# EAGLE design IO_Board (EAGLE 7.3.0)
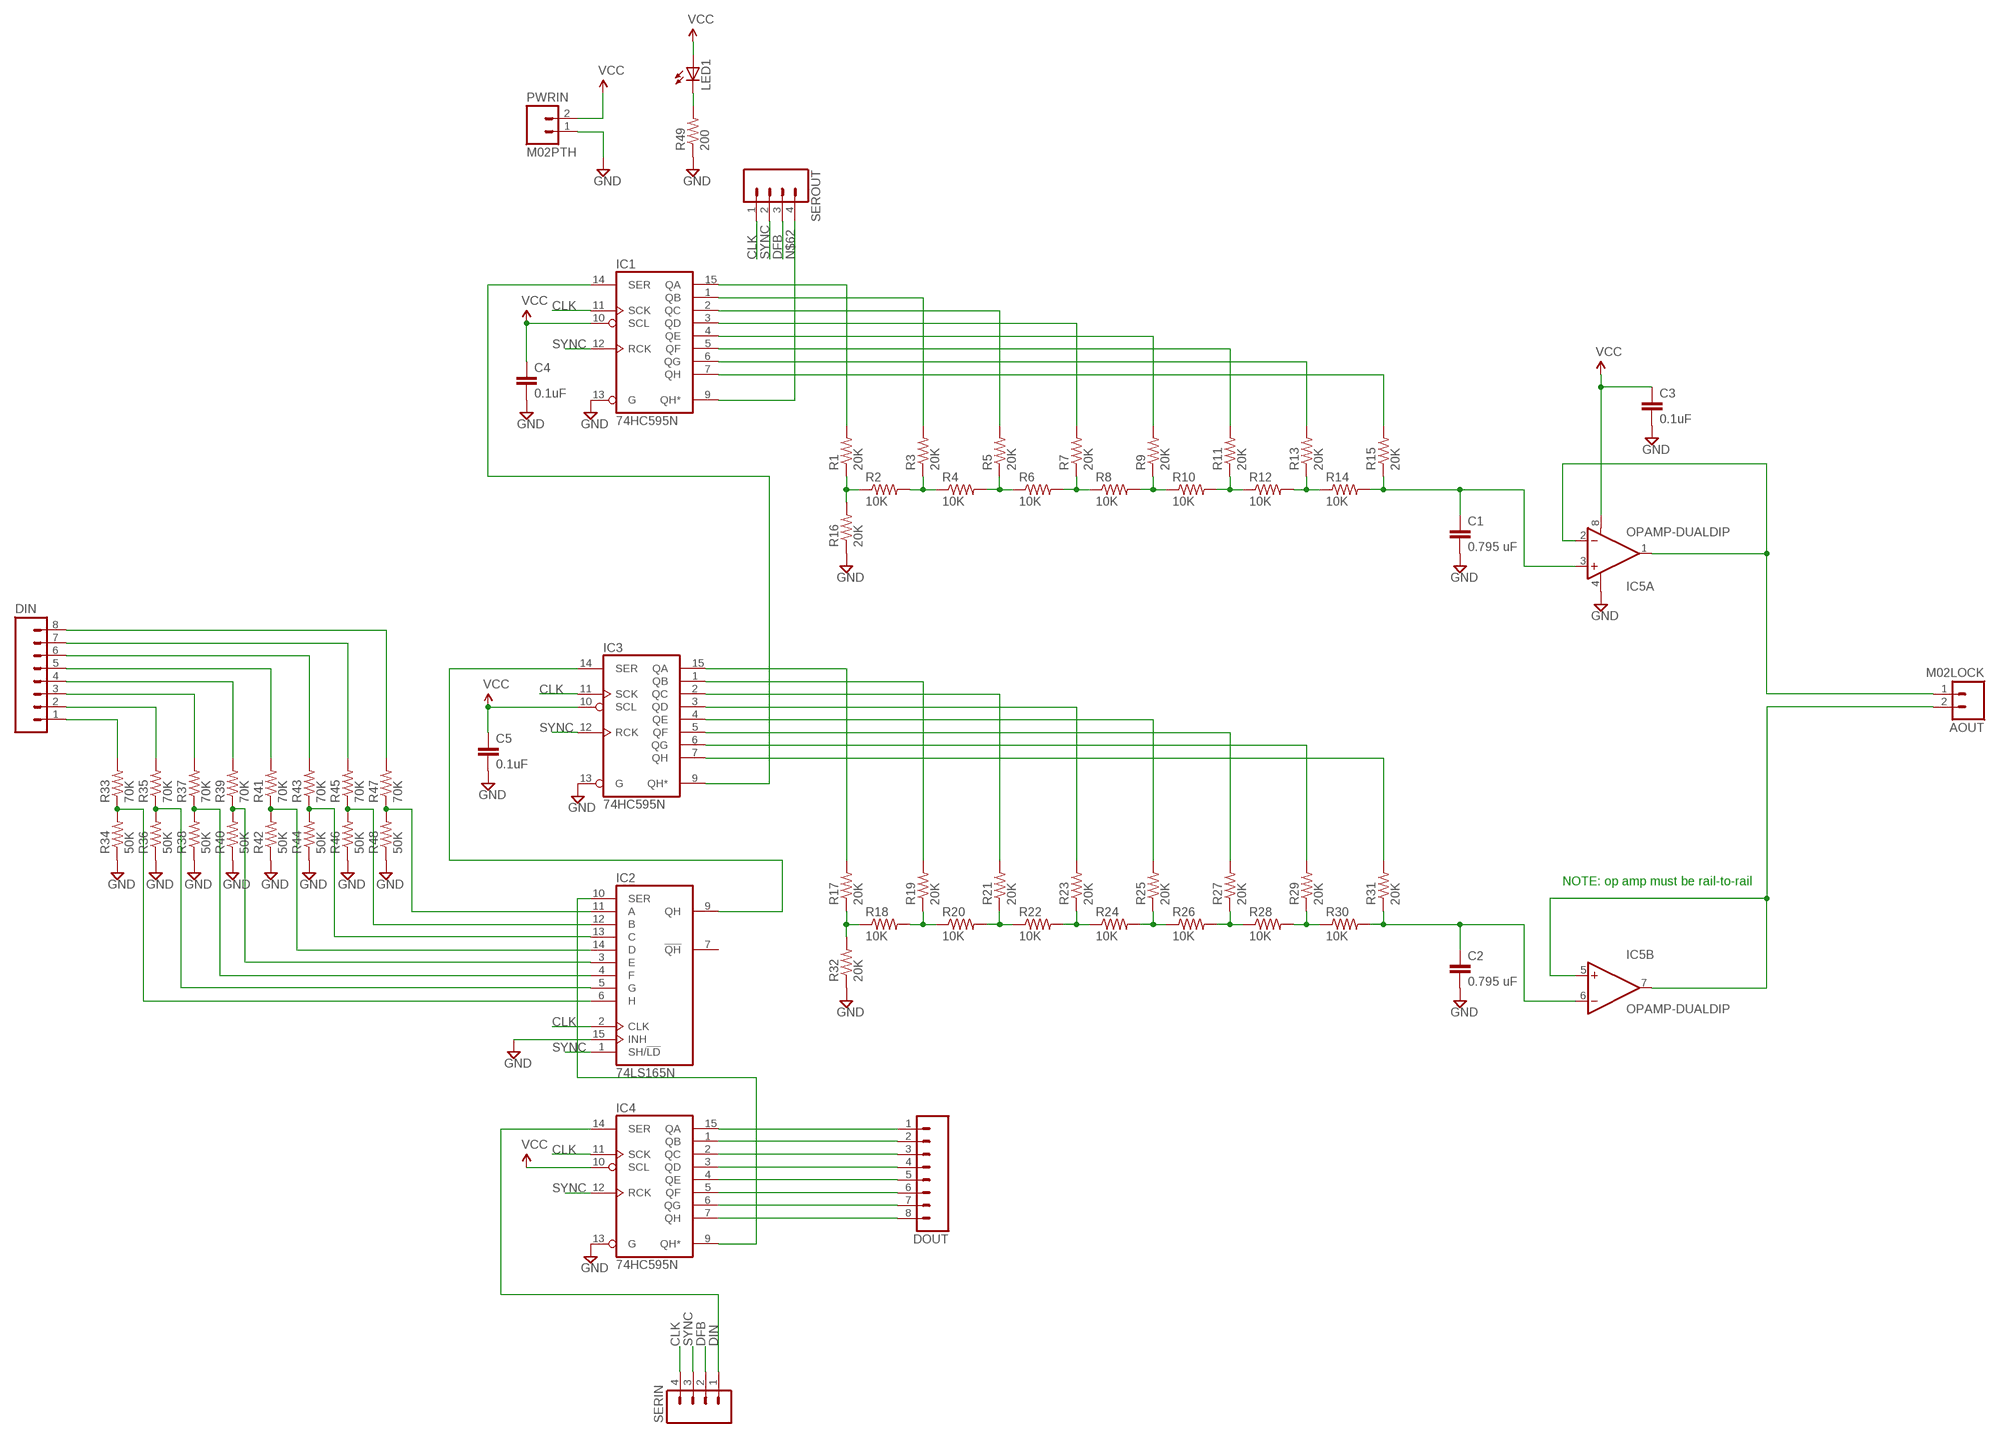
[diagram p0: schematic, sheet 1]

## Parts
AOUT  M02LOCK  [1X02_LOCK]
C1  0.795 uF  CAPPTH  [CAP-PTH-SMALL]
C2  0.795 uF  CAPPTH  [CAP-PTH-SMALL]
C3  0.1uF  CAPPTH  [CAP-PTH-SMALL]
C4  0.1uF  CAPPTH  [CAP-PTH-SMALL]
C5  0.1uF  CAPPTH  [CAP-PTH-SMALL]
DIN  M08LOCK  [1X08_LOCK]
DOUT  M08LOCK  [1X08_LOCK]
IC1  74HC595N  [DIL16]
IC2  74LS165N  [DIL16]
IC3  74HC595N  [DIL16]
IC4  74HC595N  [DIL16]
IC5  OPAMP-DUALDIP  [DIP08]
LED1  LED5MM  [LED5MM]
PWRIN  M02PTH  [1X02]
R1  20K  RESISTORPTH-1/4W-VERT  [AXIAL-0.1]
R2  10K  RESISTORPTH-1/4W-VERT  [AXIAL-0.1]
R3  20K  RESISTORPTH-1/4W-VERT  [AXIAL-0.1]
R4  10K  RESISTORPTH-1/4W-VERT  [AXIAL-0.1]
R5  20K  RESISTORPTH-1/4W-VERT  [AXIAL-0.1]
R6  10K  RESISTORPTH-1/4W-VERT  [AXIAL-0.1]
R7  20K  RESISTORPTH-1/4W-VERT  [AXIAL-0.1]
R8  10K  RESISTORPTH-1/4W-VERT  [AXIAL-0.1]
R9  20K  RESISTORPTH-1/4W-VERT  [AXIAL-0.1]
R10  10K  RESISTORPTH-1/4W-VERT  [AXIAL-0.1]
R11  20K  RESISTORPTH-1/4W-VERT  [AXIAL-0.1]
R12  10K  RESISTORPTH-1/4W-VERT  [AXIAL-0.1]
R13  20K  RESISTORPTH-1/4W-VERT  [AXIAL-0.1]
R14  10K  RESISTORPTH-1/4W-VERT  [AXIAL-0.1]
R15  20K  RESISTORPTH-1/4W-VERT  [AXIAL-0.1]
R16  20K  RESISTORPTH-1/4W-VERT  [AXIAL-0.1]
R17  20K  RESISTORPTH-1/4W-VERT  [AXIAL-0.1]
R18  10K  RESISTORPTH-1/4W-VERT  [AXIAL-0.1]
R19  20K  RESISTORPTH-1/4W-VERT  [AXIAL-0.1]
R20  10K  RESISTORPTH-1/4W-VERT  [AXIAL-0.1]
R21  20K  RESISTORPTH-1/4W-VERT  [AXIAL-0.1]
R22  10K  RESISTORPTH-1/4W-VERT  [AXIAL-0.1]
R23  20K  RESISTORPTH-1/4W-VERT  [AXIAL-0.1]
R24  10K  RESISTORPTH-1/4W-VERT  [AXIAL-0.1]
R25  20K  RESISTORPTH-1/4W-VERT  [AXIAL-0.1]
R26  10K  RESISTORPTH-1/4W-VERT  [AXIAL-0.1]
R27  20K  RESISTORPTH-1/4W-VERT  [AXIAL-0.1]
R28  10K  RESISTORPTH-1/4W-VERT  [AXIAL-0.1]
R29  20K  RESISTORPTH-1/4W-VERT  [AXIAL-0.1]
R30  10K  RESISTORPTH-1/4W-VERT  [AXIAL-0.1]
R31  20K  RESISTORPTH-1/4W-VERT  [AXIAL-0.1]
R32  20K  RESISTORPTH-1/4W-VERT  [AXIAL-0.1]
R33  70K  RESISTORPTH-1/4W-VERT  [AXIAL-0.1]
R34  50K  RESISTORPTH-1/4W-VERT  [AXIAL-0.1]
R35  70K  RESISTORPTH-1/4W-VERT  [AXIAL-0.1]
R36  50K  RESISTORPTH-1/4W-VERT  [AXIAL-0.1]
R37  70K  RESISTORPTH-1/4W-VERT  [AXIAL-0.1]
R38  50K  RESISTORPTH-1/4W-VERT  [AXIAL-0.1]
R39  70K  RESISTORPTH-1/4W-VERT  [AXIAL-0.1]
R40  50K  RESISTORPTH-1/4W-VERT  [AXIAL-0.1]
R41  70K  RESISTORPTH-1/4W-VERT  [AXIAL-0.1]
R42  50K  RESISTORPTH-1/4W-VERT  [AXIAL-0.1]
R43  70K  RESISTORPTH-1/4W-VERT  [AXIAL-0.1]
R44  50K  RESISTORPTH-1/4W-VERT  [AXIAL-0.1]
R45  70K  RESISTORPTH-1/4W-VERT  [AXIAL-0.1]
R46  50K  RESISTORPTH-1/4W-VERT  [AXIAL-0.1]
R47  70K  RESISTORPTH-1/4W-VERT  [AXIAL-0.1]
R48  50K  RESISTORPTH-1/4W-VERT  [AXIAL-0.1]
R49  200  RESISTORPTH-1/4W-VERT  [AXIAL-0.1]
SERIN  M04LOCK  [1X04_LOCK]
SEROUT  M04LOCK  [1X04_LOCK]

## Nets
CLK [Clk]: IC1.11(SCK) IC2.2(CLK) IC3.11(SCK) IC4.11(SCK) SERIN.4 SEROUT.1
DFB [Data]: SERIN.2 SEROUT.3
DIN [Data]: IC4.14(SER) SERIN.1
GND: C1.2 C2.2 C3.2 C4.2 C5.2 IC1.13(G) IC2.15(INH) IC3.13(G) IC4.13(G) IC5.4(A:V-) PWRIN.1 R16.P$1 R32.P$1 R34.P$1 R36.P$1 R38.P$1 R40.P$1 R42.P$1 R44.P$1 R46.P$1 R48.P$1 R49.P$1
N$1: IC1.7(QH) R15.P$2
N$2: AOUT.2 IC5.5(B:+IN) IC5.7(B:OUT)
N$3: IC1.6(QG) R13.P$2
N$4: IC1.5(QF) R11.P$2
N$5: IC1.4(QE) R9.P$2
N$6: IC1.3(QD) R7.P$2
N$7: IC1.2(QC) R5.P$2
N$8: IC1.1(QB) R3.P$2
N$9: IC1.15(QA) R1.P$2
N$10: R1.P$1 R2.P$1 R16.P$2
N$11: R2.P$2 R3.P$1 R4.P$1
N$12: R4.P$2 R5.P$1 R6.P$1
N$13: R6.P$2 R7.P$1 R8.P$1
N$14: R8.P$2 R9.P$1 R10.P$1
N$15: R10.P$2 R11.P$1 R12.P$1
N$16: R12.P$2 R13.P$1 R14.P$1
N$17: C1.1 IC5.3(A:+IN) R14.P$2 R15.P$1
N$18: AOUT.1 IC5.1(A:OUT) IC5.2(A:-IN)
N$19: IC3.7(QH) R31.P$2
N$20: IC3.6(QG) R29.P$2
N$21: IC3.5(QF) R27.P$2
N$22: IC3.4(QE) R25.P$2
N$23: IC3.3(QD) R23.P$2
N$24: IC3.2(QC) R21.P$2
N$25: IC3.1(QB) R19.P$2
N$26: IC3.15(QA) R17.P$2
N$27: R17.P$1 R18.P$1 R32.P$2
N$28: R18.P$2 R19.P$1 R20.P$1
N$29: R20.P$2 R21.P$1 R22.P$1
N$30: R22.P$2 R23.P$1 R24.P$1
N$31: R24.P$2 R25.P$1 R26.P$1
N$32: R26.P$2 R27.P$1 R28.P$1
N$33: R28.P$2 R29.P$1 R30.P$1
N$34: C2.1 IC5.6(B:-IN) R30.P$2 R31.P$1
N$35: IC2.6(H) R33.P$1 R34.P$2
N$36: IC2.5(G) R35.P$1 R36.P$2
N$37: IC2.4(F) R37.P$1 R38.P$2
N$38: IC2.3(E) R39.P$1 R40.P$2
N$39: IC2.14(D) R41.P$1 R42.P$2
N$40: IC2.13(C) R43.P$1 R44.P$2
N$41: IC2.12(B) R45.P$1 R46.P$2
N$42: IC2.11(A) R47.P$1 R48.P$2
N$43: DOUT.1 IC4.15(QA)
N$44: DOUT.2 IC4.1(QB)
N$45: DOUT.3 IC4.2(QC)
N$46: DOUT.4 IC4.3(QD)
N$47: DOUT.5 IC4.4(QE)
N$48: DOUT.6 IC4.5(QF)
N$49: DOUT.7 IC4.6(QG)
N$50: DOUT.8 IC4.7(QH)
N$51: DIN.8 R47.P$2
N$52: DIN.7 R45.P$2
N$53: DIN.6 R43.P$2
N$54: DIN.5 R41.P$2
N$55: DIN.4 R39.P$2
N$56: DIN.3 R37.P$2
N$57: DIN.2 R35.P$2
N$58: DIN.1 R33.P$2
N$59 [Data]: IC2.10(SER)
N$60 [Data]: IC2.9(QH) IC3.14(SER)
N$61: LED1.K(C) R49.P$2
N$62 [Data]: IC1.9(QH*) SEROUT.4
N$63 [Data]: IC1.14(SER) IC3.9(QH*)
SYNC [Sync]: IC1.12(RCK) IC2.1(SH/!LD) IC3.12(RCK) IC4.12(RCK) SERIN.3 SEROUT.2
VCC: C3.1 C4.1 C5.1 IC1.10(SCL) IC3.10(SCL) IC4.10(SCL) IC5.8(A:V+) LED1.A PWRIN.2
Unconnected: IC2.7(!QH) IC4.9(QH*)

## Notes on the sheet
- NOTE: op amp must be rail-to-rail

## Power pins joined to a net without a drawn wire
GND: IC1.8(GND) IC2.8(GND) IC3.8(GND) IC4.8(GND)
VCC: IC1.16(VCC) IC2.16(VCC) IC3.16(VCC) IC4.16(VCC)

## Library data of the parts
AOUT PWRIN = SparkFun-Connectors:M02: Standard 2-pin 0.1" header. Use with - straight break away headers ( PRT-00116) - right angle break away headers (PRT-00553) - swiss pins (PRT-00743) - machine pins (PRT-00117) - female headers (PRT-00115) Molex polarized connector foot print use with: PRT-08233 with associated crimp pins and housings. 2.54_SCREWTERM for use with PRT-10571. 3.5mm Screw Terminal footprints for PRT-08084 5mm Screw Terminal footprints for use with PRT-08433
C1-C5 = SparkFun-Passives:CAP: Capacitor Standard 0603 ceramic capacitor, and 0.1" leaded capacitor.
DIN DOUT = SparkFun-Connectors:M08: Header 8 Standard 8-pin 0.1" header. Use with straight break away headers (SKU : PRT-00116), right angle break away headers (PRT-00553), swiss pins (PRT-00743), machine pins (PRT-00117), and female headers (PRT-00115).
IC1 IC3 IC4 = 74xx-eu:74*595: 8-bit SHIFT REGISTER, output latch
IC2 = 74xx-epl:74*165: 8-bit parallel load SHIFT REGISTER
IC5 = SparkFun-AnalogIC:OPAMP-DUAL: Generic op-amp footprint
LED1 = SparkFun-LED:LED: LEDs Standard schematic elements and footprints for 5mm, 3mm, 1206, and 0603 sized LEDs. 5mm - Spark Fun Electronics SKU : COM-00529 (and others)
R1-R49 = SparkFun-Resistors:RESISTOR: Resistor Basic schematic elements and footprints for 0603, 1206, and PTH resistors.
SERIN SEROUT = SparkFun-Connectors:M04: Header 4 Standard 4-pin 0.1" header. Use with straight break away headers (SKU : PRT-00116), right angle break away headers (PRT-00553), swiss pins (PRT-00743), machine pins (PRT-00117), and female headers (PRT-00115). Molex polarized connector foot print use with SKU : PRT-08231 with associated crimp pins and housings. 1MM SMD Version SKU: PRT-10208

## Net classes
0 default: width 0.61 mm, clearance 0.508 mm
1 Clk: width 0.61 mm, clearance 2.515 mm to class 0, clearance 0.508 mm
2 Data: width 0.61 mm, clearance 0.508 mm to class 0, clearance 2.515 mm to class 1, clearance 0.508 mm
3 Sync: width 0.61 mm, clearance 0.508 mm to class 0, clearance 2.515 mm to class 1, clearance 0.508 mm to class 2, clearance 0.508 mm

## Board
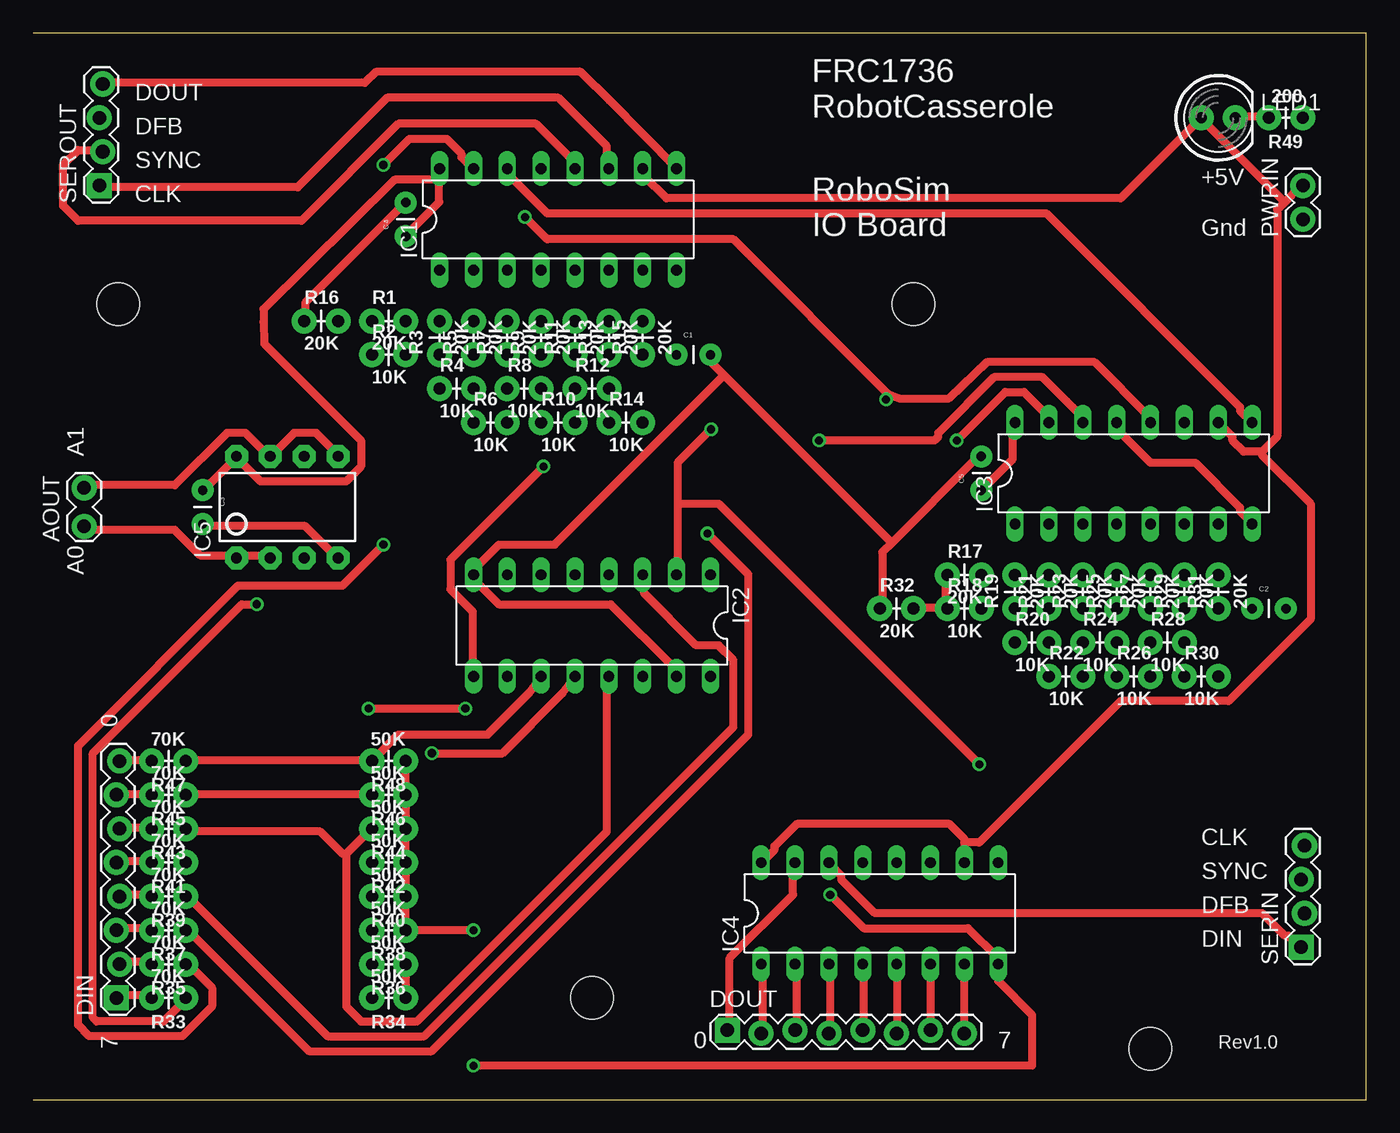
[diagram p1: board, top side]
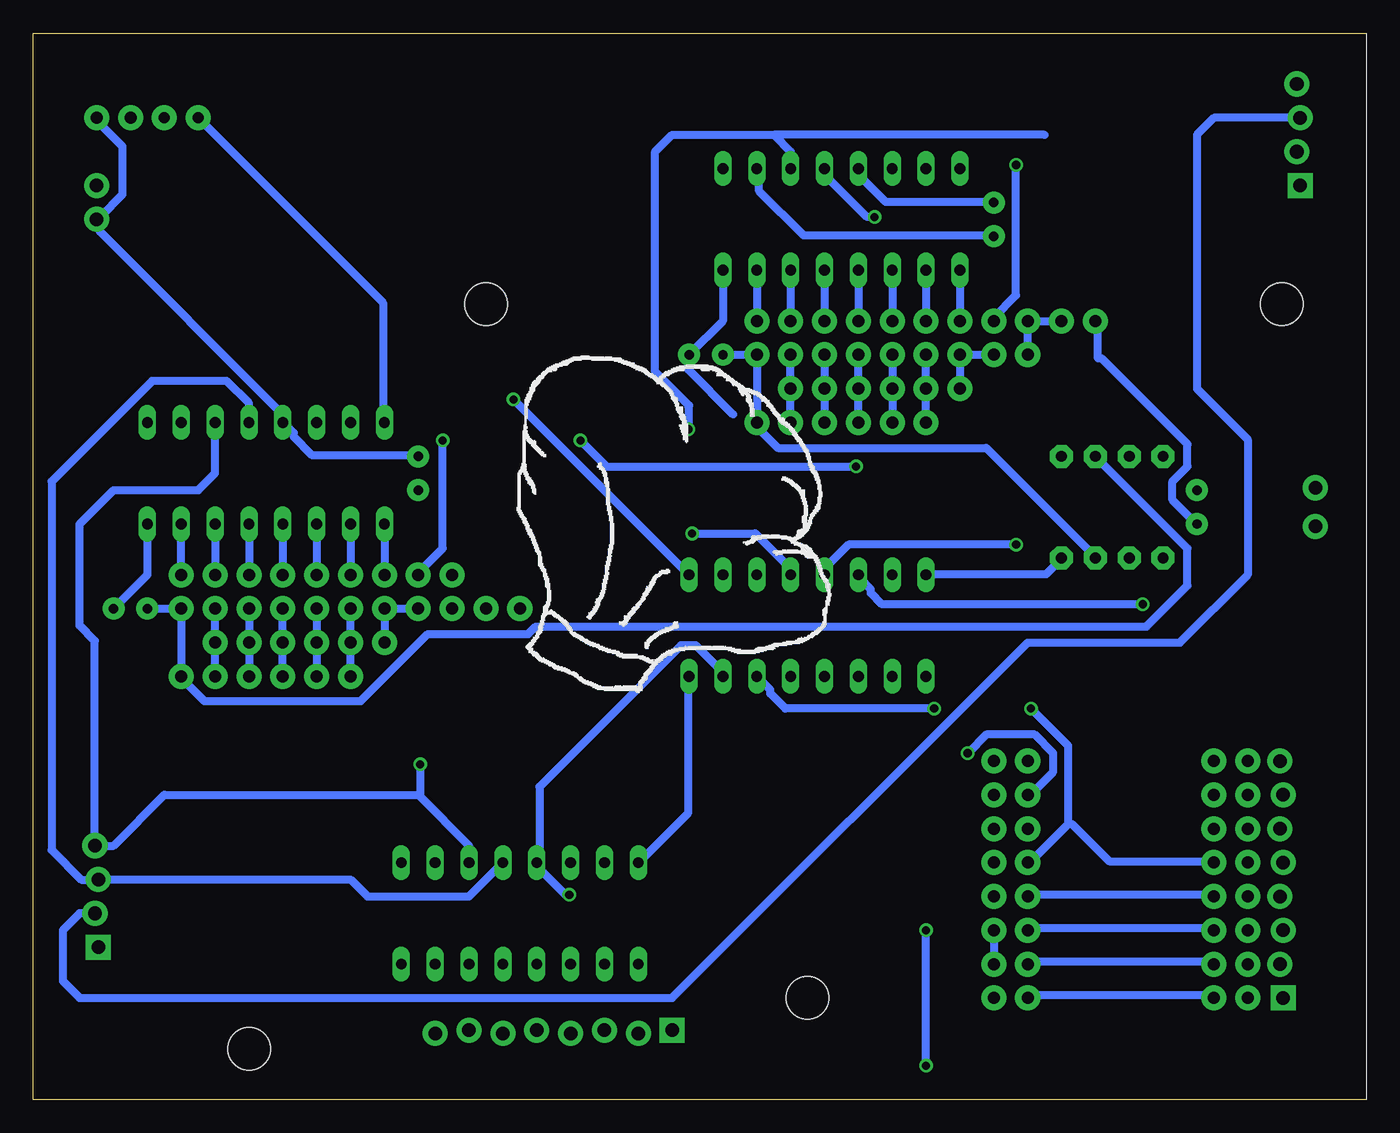
[diagram p2: board, bottom side, seen from below]

Size 100 x 80 mm. Coordinates in mm from the lower left corner, seen from the top.
Outline: 0,0 100,0 100,80 0,80
Copper layers (1*16): Top 0.035mm / dielectric 1.5mm / Bottom 0.035mm
Design rules "default": minimum track width 10mil, minimum drill 24mil, track to track 8mil, track to pad 8mil, pad to pad 8mil, via to via 8mil, smd to smd 8mil, copper to edge 40mil, drill to drill 8mil, minimum pad ring 10mil, minimum via ring 8mil, stop-mask expansion 4mil, vias tented up to drill 0mil, thermal gap 10mil
Holes 3.2 mm at 6.35,59.69 66.04,59.69 41.91,7.62 83.82,3.81

### Footprints (pad centres in the part's own frame; a part is rotated, then mirrored left to right if it is on the bottom)
1X02_LOCK = drill 1.016 pad 1.88: 1 -0.178,0; 2 2.718,0
CAP-PTH-SMALL = drill 0.7 pad 1.651: 1 0,0; 2 2.54,0
1X08_LOCK = drill 1.016 pad 1.88 square: 1 0,0.127 | drill 1.016 pad 1.88: 2 2.54,-0.127; 3 5.08,0.127; 4 7.62,-0.127; 5 10.16,0.127; 6 12.7,-0.127; 7 15.24,0.127; 8 17.78,-0.127
DIL16 = drill 0.813 long: 1 -8.89,-3.81; 2 -6.35,-3.81; 3 -3.81,-3.81; 4 -1.27,-3.81; 5 1.27,-3.81; 6 3.81,-3.81; 7 6.35,-3.81; 8 8.89,-3.81; 9 8.89,3.81; 10 6.35,3.81; 11 3.81,3.81; 12 1.27,3.81; 13 -1.27,3.81; 14 -3.81,3.81; 15 -6.35,3.81; 16 -8.89,3.81
DIP08 = drill 0.813 pad 1.727 octagon: 1 -3.81,-3.81; 2 -1.27,-3.81; 3 1.27,-3.81; 4 3.81,-3.81; 5 3.81,3.81; 6 1.27,3.81; 7 -1.27,3.81; 8 -3.81,3.81
LED5MM = drill 0.813 pad 1.88: A -1.27,0; K 1.27,0
1X02 = drill 1.016 pad 1.88: 1 0,0; 2 2.54,0
AXIAL-0.1 = drill 0.9 pad 1.88: P$1 0,0; P$2 2.54,0
1X04_LOCK = drill 1.016 pad 1.88 square: 1 0,0.127 | drill 1.016 pad 1.88: 2 2.54,-0.127; 3 5.08,0.127; 4 7.62,-0.127

### Placement (x,y rotation side)
AOUT  3.81,43.18 90 top
C1  48.26,55.88 0 top
C2  91.44,36.83 0 top
C3  12.7,45.72 270 top
C4  27.94,64.77 90 top
C5  71.12,45.72 90 top
DIN  6.35,7.62 90 top
DOUT  52.07,5.08 0 top
IC1  39.37,66.04 0 top
IC2  41.91,35.56 180 top
IC3  82.55,46.99 0 top
IC4  63.5,13.97 0 top
IC5  19.05,44.45 0 top
LED1  88.9,73.66 0 top
PWRIN  95.25,66.04 90 top
R1  25.4,58.42 0 top
R2  25.4,55.88 0 top
R3  30.48,55.88 90 top
R4  30.48,53.34 0 top
R5  33.02,55.88 90 top
R6  33.02,50.8 0 top
R7  35.56,55.88 90 top
R8  35.56,53.34 0 top
R9  38.1,55.88 90 top
R10  38.1,50.8 0 top
R11  40.64,55.88 90 top
R12  40.64,53.34 0 top
R13  43.18,55.88 90 top
R14  43.18,50.8 0 top
R15  45.72,55.88 90 top
R16  20.32,58.42 0 top
R17  68.58,39.37 0 top
R18  68.58,36.83 0 top
R19  73.66,36.83 90 top
R20  73.66,34.29 0 top
R21  76.2,36.83 90 top
R22  76.2,31.75 0 top
R23  78.74,36.83 90 top
R24  78.74,34.29 0 top
R25  81.28,36.83 90 top
R26  81.28,31.75 0 top
R27  83.82,36.83 90 top
R28  83.82,34.29 0 top
R29  86.36,36.83 90 top
R30  86.36,31.75 0 top
R31  88.9,36.83 90 top
R32  63.5,36.83 0 top
R33  11.43,7.62 180 top
R34  27.94,7.62 180 top
R35  11.43,10.16 180 top
R36  27.94,10.16 180 top
R37  11.43,12.7 180 top
R38  27.94,12.7 180 top
R39  11.43,15.24 180 top
R40  27.94,15.24 180 top
R41  11.43,17.78 180 top
R42  27.94,17.78 180 top
R43  11.43,20.32 180 top
R44  27.94,20.32 180 top
R45  11.43,22.86 180 top
R46  27.94,22.86 180 top
R47  11.43,25.4 180 top
R48  27.94,25.4 180 top
R49  95.25,73.66 180 top
SERIN  95.25,11.43 90 top
SEROUT  5.08,68.58 90 top

### Tracks (layer width: path | path; a pad name or v marks a point on that pad's centre or on a via)
CLK  (via drill 0.61)
  Top 0.61: 48.34,44.7 48.34,47.78 v50.85,50.29 | 48.34,44.7 48.34,39.4 IC2.2 | SEROUT.1 5.03,68.45 19.84,68.45 26.54,75.16 39.4,75.16 43.03,71.53 43.03,69.85 IC1.11 | v70.97,25.15 51.41,44.7 48.34,44.7
  Bottom 0.406: 43.18,71.12 IC1.11
  Bottom 0.61: IC3.11 86.36,46.99 87.63,45.72 93.98,45.72 96.52,43.18 96.52,35.56 95.38,34.42 SERIN.4 93.98,19.05 90.17,22.86 71.12,22.86 71.07,22.81 | 44.45,72.39 52.07,72.39 53.34,71.12 53.34,54.61 50.8,52.07 50.85,51.97 v50.85,50.29 | 44.45,72.39 43.18,71.12 | 24.13,72.39 44.45,72.39 | 71.07,22.81 67.31,19.05 IC4.11 | v70.97,25.15 70.97,22.91 71.07,22.81
DFB
  Bottom 0.61: SEROUT.3 11.43,73.66 12.7,72.39 12.7,53.34 8.89,49.53 8.89,39.37 13.97,34.29 25.4,34.29 52.07,7.62 96.52,7.62 97.79,8.89 97.79,12.7 96.52,13.97 SERIN.2
DIN
  Top 0.61: SERIN.1 95,11.46 94.16,12.29 93.88,12.29 92.2,13.97 63.14,13.97 60.63,16.48 60.63,16.76 59.79,17.6 IC4.14
GND  (via drill 0.6, 0.61)
  Top 0.61: IC3.8 91.36,43.31 90.53,44.15 90.53,44.42 87.17,47.78 83.82,47.78 81.03,50.57 IC3.13 | 70.97,48.06 C5.2 70.69,48.06 64.4,41.77 | R16.P$1 20.4,58.67 20.4,59.79 27.94,67.33 C4.2 | R48.P$1 R46.P$1 R44.P$1 R42.P$1 R40.P$1 R38.P$1 v33.02,12.7 | R36.P$1 R34.P$1 | 64.4,41.77 63.7,41.07 63.7,36.88 R32.P$1 | 64.4,41.77 51.83,54.34 | 51.83,54.34 50.85,55.32 50.85,55.88 C1.2 | IC2.15 48.06,31.85 48.06,32.41 43.31,37.16 34.92,37.16 32.97,39.12 IC2.8 32.97,39.67 34.92,41.63 39.12,41.63 51.83,54.34 | C3.2 12.85,43.03 20.4,43.03 22.63,40.79 IC5.4 | v59.79,15.37 62.31,12.85 70.13,12.85 72.39,10.59 IC4.8 72.39,8.89 74.93,6.35 74.93,2.54 v33.02,2.54
  Bottom 0.61: IC1.8 48.26,58.42 C1.2 50.85,55.6 50.85,54.76 47.5,51.41 | IC3.8 91.44,39.37 C2.2 | R49.P$1 95.28,73.48 93.32,71.53 93.32,67.89 95,66.22 PWRIN.1 95,65.94 95,65.1 81.58,51.69 81.58,50.85 IC3.13 81.03,50.57 80.47,50.01 80.47,49.73 79.07,48.34 71.25,48.34 C5.2 | IC1.13 38,69.85 38,69.29 36.04,67.33 27.94,67.33 C4.2 | R16.P$1 20.12,58.4 20.12,55.6 19.84,55.6 13.41,49.17 13.41,47.5 14.53,46.38 14.53,44.98 12.85,43.31 C3.2 | 28.22,12.29 27.94,12.57 R38.P$1 R36.P$1 | IC2.8 32.97,39.4 24.03,39.4 22.91,40.51 IC5.4 | IC2.15 48.06,31.85 50.29,34.09 51.41,34.09 62.03,23.47 62.03,17.88 IC4.13 62.31,17.6 60.07,15.37 v59.79,15.37 | v33.02,2.54 v33.02,12.7
N$1
  Bottom 0.61: IC1.7 R15.P$2
N$2
  Top 0.61: IC5.5 22.91,48.34 21.23,50.01 19.56,50.01 17.88,48.34 IC5.7 17.6,48.34 15.93,50.01 14.53,50.01 10.62,46.1 3.91,46.1 AOUT.2
N$3
  Bottom 0.61: IC1.6 R13.P$2
N$4
  Bottom 0.61: IC1.5 R11.P$2
N$5
  Bottom 0.61: IC1.4 R9.P$2
N$6
  Bottom 0.61: IC1.3 R7.P$2
N$7
  Bottom 0.61: IC1.2 R5.P$2
N$8
  Bottom 0.61: IC1.1 R3.P$2
N$9  (via drill 0.61)
  Top 0.61: v26.26,70.13 28.22,72.08 31.01,72.08 32.13,70.97 32.13,70.69 32.97,69.85 IC1.15
  Bottom 0.61: v26.26,70.13 26.26,60.35 27.94,58.67 R1.P$2
N$10
  Bottom 0.61: R2.P$1 R1.P$1 R16.P$2
N$11
  Bottom 0.61: R4.P$1 R3.P$1 R2.P$2
N$12
  Bottom 0.61: R6.P$1 R4.P$2 R5.P$1
N$13
  Bottom 0.61: R7.P$1 R8.P$1 R6.P$2
N$14
  Bottom 0.61: R10.P$1 R8.P$2 R9.P$1
N$15
  Bottom 0.61: R11.P$1 R12.P$1 R10.P$2
N$16
  Bottom 0.61: R14.P$1 R12.P$2 R13.P$1
N$17
  Bottom 0.61: C1.1 R15.P$1 R14.P$2 | 45.54,50.57 R14.P$2 | IC5.3 20.4,40.79 28.5,48.9 44.15,48.9 45.54,50.29 R14.P$2
N$18
  Top 0.61: IC5.2 17.6,40.79 15.37,40.79 IC5.1 15.09,40.79 12.57,40.79 10.62,42.75 3.91,42.75 AOUT.1
N$19
  Bottom 0.61: R31.P$2 IC3.7
N$20
  Bottom 0.61: IC3.6 R29.P$2
N$21
  Bottom 0.61: IC3.5 R27.P$2
N$22
  Bottom 0.61: IC3.4 R25.P$2
N$23
  Bottom 0.61: IC3.3 R23.P$2
N$24
  Bottom 0.61: IC3.2 R21.P$2
N$25
  Bottom 0.61: IC3.1 R19.P$2
N$26  (via drill 0.61)
  Top 0.61: v69.29,49.45 72.92,53.09 74.32,53.09 76,51.41 76,50.85 IC3.15
  Bottom 0.61: v69.29,49.45 69.29,41.35 71.25,39.4 R17.P$2
N$27
  Top 0.61: R32.P$2 66.22,36.88 68.45,36.88 R18.P$1 68.45,37.16 68.45,39.12 R17.P$1
N$28
  Bottom 0.61: R20.P$1 R19.P$1 R18.P$2
N$29
  Bottom 0.61: R22.P$1 R20.P$2 R21.P$1
N$30
  Bottom 0.61: R23.P$1 R24.P$1 R22.P$2
N$31
  Bottom 0.61: R26.P$1 R24.P$2 R25.P$1
N$32
  Bottom 0.61: R27.P$1 R28.P$1 R26.P$2
N$33
  Bottom 0.61: R30.P$1 R28.P$2 R29.P$1
N$34
  Bottom 0.61: C2.1 R31.P$1 R30.P$2 88.85,31.57 87.17,29.9 75.44,29.9 70.41,34.92 62.87,34.92 62.31,35.48 16.48,35.48 13.41,38.56 13.41,41.35 IC5.6
N$35  (via drill 0.61)
  Top 0.61: v16.76,37.16 15.65,37.16 4.47,25.98 4.47,6.15 4.75,5.87 9.78,5.87 11.46,7.54 R33.P$1
  Bottom 0.61: v16.76,37.16 36.32,37.16 37.16,38 37.16,38.28 38,39.12 IC2.6 | R34.P$2 25.15,7.82 11.46,7.82 R33.P$1
N$36  (via drill 0.61)
  Top 0.61: v26.26,41.63 23.19,38.56 15.37,38.56 3.35,26.54 3.35,5.59 4.19,4.75 11.18,4.75 13.41,6.99 13.41,8.38 11.46,10.34 R35.P$1
  Bottom 0.61: v26.26,41.63 38.84,41.63 40.51,39.95 40.51,39.4 IC2.5 | R36.P$2 25.15,10.34 11.46,10.34 R35.P$1
N$37  (via drill 0.61)
  Top 0.61: v50.57,42.47 53.65,39.4 53.65,27.38 29.9,3.63 20.68,3.63 11.46,12.85 R37.P$1
  Bottom 0.61: v50.57,42.47 45.82,42.47 43.31,39.95 43.31,39.4 IC2.4 | R38.P$2 25.15,12.85 11.46,12.85 R37.P$1
N$38
  Top 0.61: IC2.3 45.82,39.12 45.82,38 49.73,34.09 51.41,34.09 52.53,32.97 52.53,27.94 29.34,4.75 22.07,4.75 11.46,15.37 R39.P$1
  Bottom 0.61: R40.P$2 25.15,15.37 11.46,15.37 R39.P$1
N$39  (via drill 0.61)
  Top 0.61: v25.15,29.34 v32.41,29.34
  Bottom 0.61: IC2.14 44.7,30.73 44.7,30.45 43.59,29.34 v32.41,29.34 | v25.15,29.34 22.35,26.54 22.35,20.68 | 22.35,20.68 25.15,17.88 R42.P$2 | R41.P$1 11.46,17.88 19.28,17.88 22.07,20.68 22.35,20.68
N$40
  Top 0.61: 23.47,18.44 23.47,6.99 24.59,5.87 28.78,5.87 43.03,20.12 43.03,31.57 IC2.13 | 23.47,18.44 25.15,20.12 R44.P$2 | R43.P$1 11.46,20.12 21.51,20.12 23.19,18.44 23.47,18.44
N$41  (via drill 0.61)
  Top 0.61: v29.9,25.98 35.2,25.98 39.67,30.45 39.67,30.48 40.51,31.57 IC2.12 | R45.P$1 11.46,22.91 25.15,22.91 R46.P$2
  Bottom 0.61: v29.9,25.98 28.5,27.38 24.87,27.38 23.47,25.98 23.47,24.59 25.15,22.91 R46.P$2
N$42
  Top 0.61: IC2.11 38,31.57 37.16,30.48 37.16,30.45 34.09,27.38 27.38,27.38 R48.P$2 25.15,25.43 11.46,25.43 R47.P$1
N$43
  Top 0.61: IC4.15 57,17.6 57,15.37 52.25,10.62 52.25,5.31 DOUT.1
N$44
  Top 0.61: IC4.1 54.76,10.06 54.76,5.03 DOUT.2
N$45
  Top 0.61: IC4.2 57.28,10.06 57.28,5.31 DOUT.3
N$46
  Top 0.61: IC4.3 59.79,10.06 59.79,5.03 DOUT.4
N$47
  Top 0.61: IC4.4 62.31,10.06 62.31,5.31 DOUT.5
N$48
  Top 0.61: IC4.5 64.82,10.06 64.82,5.03 DOUT.6
N$49
  Top 0.61: IC4.6 67.33,10.06 67.33,5.31 DOUT.7
N$50
  Top 0.61: DOUT.8 IC4.7
N$51
  Top 0.61: DIN.8 6.71,25.43 8.66,25.43 R47.P$2
N$52
  Top 0.61: DIN.7 6.43,22.91 8.66,22.91 R45.P$2
N$53
  Top 0.61: DIN.6 6.71,20.4 8.66,20.4 R43.P$2
N$54
  Top 0.61: DIN.5 6.43,17.88 8.66,17.88 R41.P$2
N$55
  Top 0.61: DIN.4 6.71,15.37 8.66,15.37 R39.P$2
N$56
  Top 0.61: DIN.3 6.43,12.85 8.66,12.85 R37.P$2
N$57
  Top 0.61: DIN.2 6.71,10.34 8.66,10.34 R35.P$2
N$58
  Top 0.61: DIN.1 6.43,7.82 8.66,7.82 R33.P$2
N$60  (via drill 0.61)
  Top 0.61: IC3.14 78.51,50.85 78.51,51.41 75.72,54.2 72.08,54.2 67.89,50.01 67.89,49.73 67.61,49.45 v58.95,49.45 | v38.28,47.5 31.29,40.51 31.29,38.28 32.97,36.6 32.97,31.85 IC2.9
  Bottom 0.61: v38.28,47.5 57,47.5 v58.95,49.45
N$61
  Top 0.61: LED1.K 90.25,73.76 92.48,73.76 R49.P$2
N$62
  Top 0.61: IC1.9 48.31,69.85 43.23,74.98 42.22,76 42.19,76 41.07,77.11 25.7,77.11 24.87,76.28 5.31,76.28 SEROUT.4
N$63
  Top 0.61: IC3.9 91.36,50.85 90.53,51.69 90.53,51.97 76,66.5 38.56,66.5 35.76,69.29 35.76,69.85 IC1.14
SYNC  (via drill 0.61)
  Top 0.61: IC1.12 40.51,69.85 40.51,70.41 37.72,73.2 27.38,73.2 20.12,65.94 3.35,65.94 2.23,67.06 2.23,70.13 3.35,71.25 5.03,71.25 SEROUT.2 | IC3.12 83.82,51.13 79.63,55.32 71.53,55.32 68.68,52.6 64.97,52.6 64.12,52.95 | v36.88,66.22 38.56,64.54 52.53,64.54 64.12,52.95 | v63.98,52.53 63.98,52.81 64.12,52.95
  Bottom 0.61: v36.88,66.22 37.44,66.22 40.51,69.29 40.51,69.85 IC1.12 | IC3.12 83.82,52.25 85.5,53.92 91.08,53.92 98.63,46.38 98.63,18.72 96.39,16.48 95.28,16.48 SERIN.3 76.2,16.51 74.93,15.24 67.31,15.24 IC4.12 | v63.98,52.53 50.85,39.4 IC2.1
VCC
  Top 0.61: C4.1 27.94,64.82 30.45,67.33 30.45,69.85 IC1.16 30.18,69.01 27.1,69.01 17.27,59.31 17.27,58.36 17.34,56.71 24.59,49.45 24.59,47.5 23.47,46.38 17.04,46.38 15.37,48.06 IC5.8 15.09,48.06 12.85,45.82 C3.1 | 69.85,19.28 IC4.10 | IC3.16 73.48,50.57 73.48,48.06 71.25,45.82 C5.1 | IC3.10 89.97,49.73 89.97,49.45 90.81,48.62 92.2,48.62 | 92.2,48.62 93.32,49.73 93.32,66.78 93.88,67.33 | 93.88,67.33 95,68.45 PWRIN.2 | 93.88,67.33 87.73,73.48 LED1.A 81.58,67.61 47.5,67.61 45.82,69.29 45.82,69.85 IC1.10 | 69.85,19.28 70.97,19.28 81.58,29.9 89.69,29.9 95.83,36.04 95.83,44.7 92.2,48.34 92.2,48.62 | IC4.16 54.76,17.88 55.6,18.72 55.6,19 57.28,20.68 68.73,20.68 69.85,19.56 69.85,19.28
  Bottom 0.61: IC1.10 45.54,69.85 45.54,68.17 42.19,64.82 27.94,64.82 C4.1 | LED1.A 73.76,59.79 73.76,50.85 IC3.16 | IC2.16 50.85,31.57 50.85,21.51 54.48,17.88 IC4.16

### Text on the board
tNames: DOUT | FRC1736 / RobotCasserole | DFB | SYNC | +5V | CLK | RoboSim / IO Board | Gnd | A1 | A0 | 0 | CLK | SYNC | DFB | DIN | 7 | 0 | 7 | Rev1.0
200bmp: C:/RobotCasserole/RoboSim/Eagle/RoboSim/hat.bmp